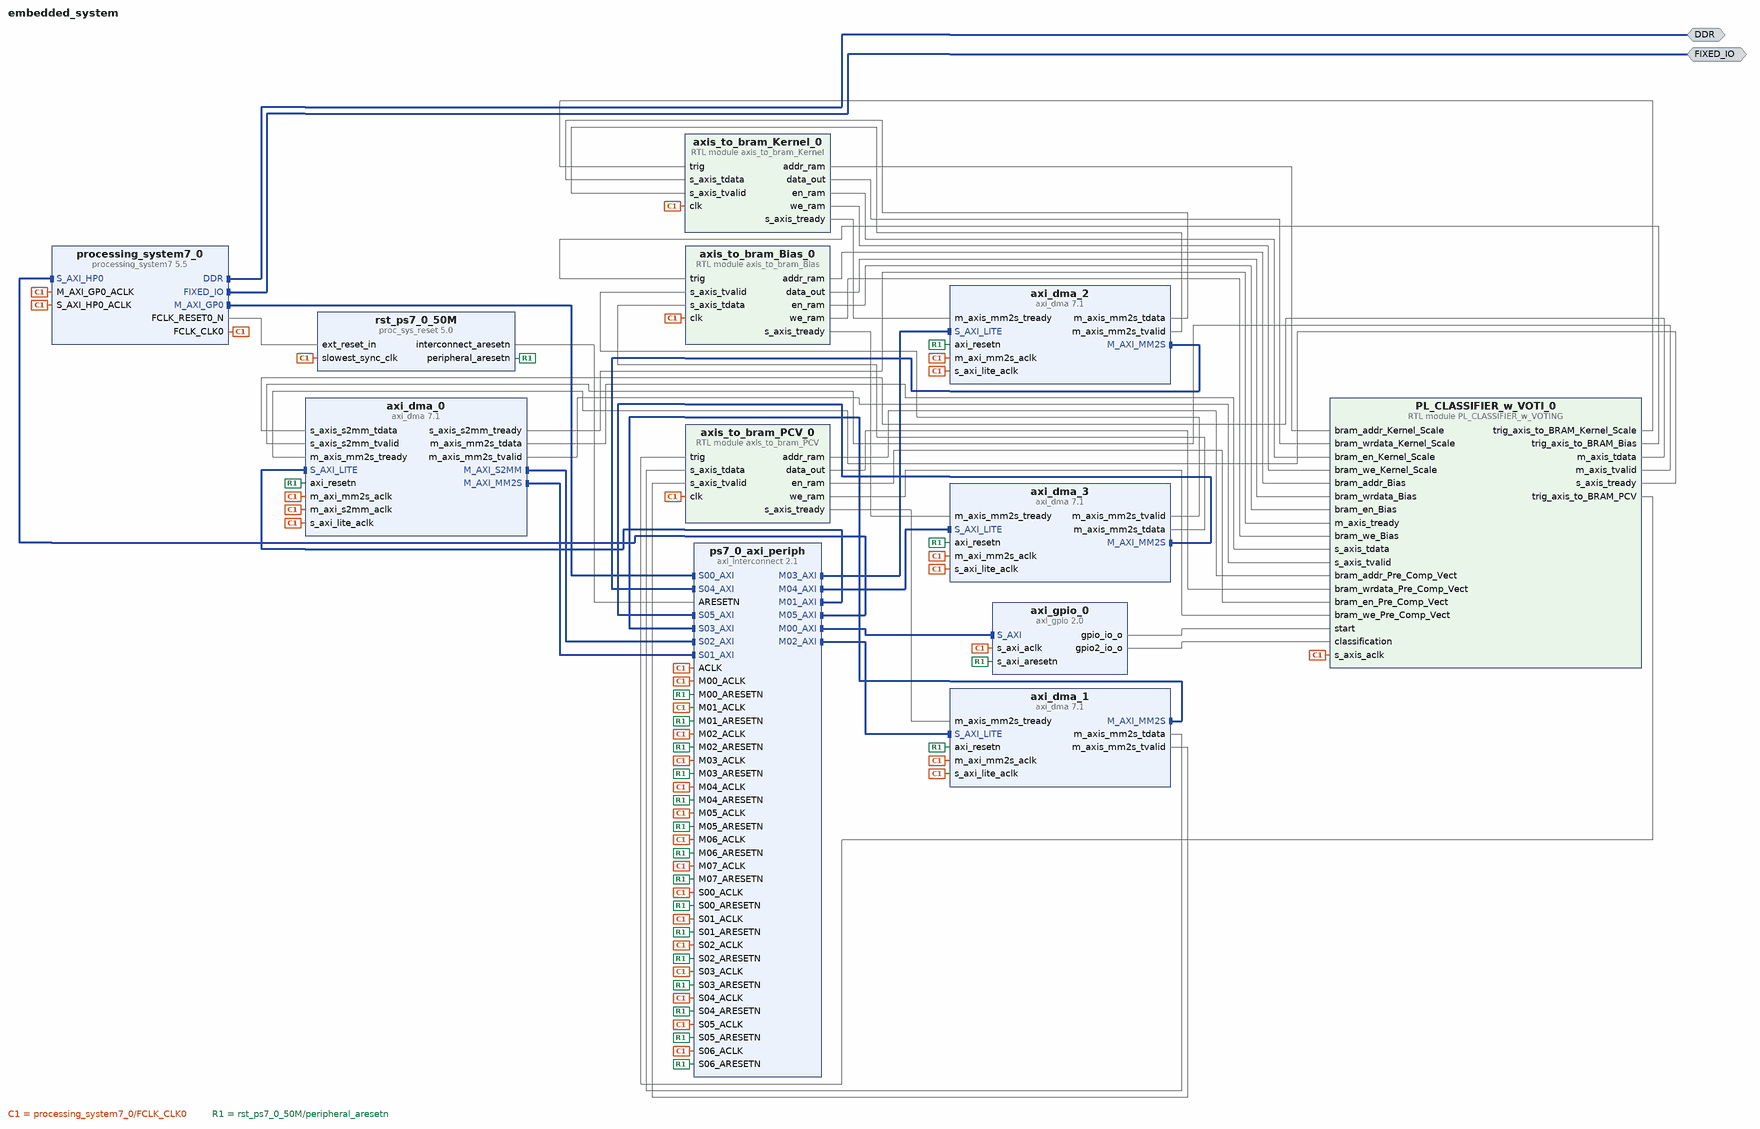
[diagram p0: block diagram of the top level]
# Vivado block design embedded_system, xc7z020clg400-1, Vivado 2018.3
create_bd_design embedded_system

create_bd_intf_port -mode Master -vlnv xilinx.com:interface:ddrx_rtl:1.0 DDR
create_bd_intf_port -mode Master -vlnv xilinx.com:display_processing_system7:fixedio_rtl:1.0 FIXED_IO

create_bd_cell -type ip -vlnv xilinx.com:ip:axi_gpio:2.0 axi_gpio_0
set_property -dict [list \
  CONFIG.C_ALL_INPUTS 0 \
  CONFIG.C_ALL_OUTPUTS 1 \
  CONFIG.C_ALL_OUTPUTS_2 1 \
  CONFIG.C_GPIO2_WIDTH 1 \
  CONFIG.C_GPIO_WIDTH 1 \
  CONFIG.C_IS_DUAL 1 \
  CONFIG.GPIO2_BOARD_INTERFACE Custom \
  CONFIG.GPIO_BOARD_INTERFACE Custom \
  CONFIG.USE_BOARD_FLOW true \
] [get_bd_cells axi_gpio_0]
create_bd_cell -type ip -vlnv xilinx.com:ip:axi_dma:7.1 axi_dma_0
set_property -dict [list \
  CONFIG.c_include_sg 0 \
  CONFIG.c_m_axi_mm2s_data_width 32 \
  CONFIG.c_micro_dma 0 \
  CONFIG.c_mm2s_burst_size 256 \
] [get_bd_cells axi_dma_0]
create_bd_cell -type ip -vlnv xilinx.com:ip:axi_interconnect:2.1 ps7_0_axi_periph
set_property -dict {CONFIG.NUM_MI 8 CONFIG.NUM_SI 7} [get_bd_cells ps7_0_axi_periph]
create_bd_cell -type ip -vlnv xilinx.com:ip:processing_system7:5.5 processing_system7_0
set_property -dict [list \
  CONFIG.PCW_APU_PERIPHERAL_FREQMHZ 650 \
  CONFIG.PCW_CRYSTAL_PERIPHERAL_FREQMHZ 50 \
  CONFIG.PCW_ENET0_ENET0_IO {MIO 16 .. 27} \
  CONFIG.PCW_ENET0_GRP_MDIO_ENABLE 1 \
  CONFIG.PCW_ENET0_GRP_MDIO_IO {MIO 52 .. 53} \
  CONFIG.PCW_ENET0_PERIPHERAL_ENABLE 1 \
  CONFIG.PCW_ENET0_RESET_ENABLE 1 \
  CONFIG.PCW_ENET0_RESET_IO {MIO 9} \
  CONFIG.PCW_ENET_RESET_ENABLE 1 \
  CONFIG.PCW_ENET_RESET_SELECT {Share reset pin} \
  CONFIG.PCW_FPGA0_PERIPHERAL_FREQMHZ 30 \
  CONFIG.PCW_FPGA1_PERIPHERAL_FREQMHZ 50 \
  CONFIG.PCW_GPIO_MIO_GPIO_ENABLE 1 \
  CONFIG.PCW_GPIO_MIO_GPIO_IO MIO \
  CONFIG.PCW_I2C_RESET_ENABLE 0 \
  CONFIG.PCW_M_AXI_GP0_FREQMHZ 10 \
  CONFIG.PCW_PERIPHERAL_BOARD_PRESET part0 \
  CONFIG.PCW_PRESET_BANK1_VOLTAGE {LVCMOS 1.8V} \
  CONFIG.PCW_QSPI_GRP_FBCLK_ENABLE 1 \
  CONFIG.PCW_QSPI_GRP_FBCLK_IO {MIO 8} \
  CONFIG.PCW_QSPI_GRP_SINGLE_SS_ENABLE 1 \
  CONFIG.PCW_QSPI_GRP_SINGLE_SS_IO {MIO 1 .. 6} \
  CONFIG.PCW_QSPI_PERIPHERAL_ENABLE 1 \
  CONFIG.PCW_QSPI_QSPI_IO {MIO 1 .. 6} \
  CONFIG.PCW_SD0_GRP_CD_ENABLE 1 \
  CONFIG.PCW_SD0_GRP_CD_IO {MIO 47} \
  CONFIG.PCW_SD0_GRP_WP_ENABLE 0 \
  CONFIG.PCW_SD0_PERIPHERAL_ENABLE 1 \
  CONFIG.PCW_SD0_SD0_IO {MIO 40 .. 45} \
  CONFIG.PCW_SDIO_PERIPHERAL_FREQMHZ 50 \
  CONFIG.PCW_SINGLE_QSPI_DATA_MODE x4 \
  CONFIG.PCW_S_AXI_HP0_DATA_WIDTH 32 \
  CONFIG.PCW_S_AXI_HP0_FREQMHZ 10 \
  CONFIG.PCW_UART0_PERIPHERAL_ENABLE 1 \
  CONFIG.PCW_UART0_UART0_IO {MIO 14 .. 15} \
  CONFIG.PCW_UART1_PERIPHERAL_ENABLE 0 \
  CONFIG.PCW_UART_PERIPHERAL_FREQMHZ 100 \
  CONFIG.PCW_UIPARAM_DDR_BUS_WIDTH {16 Bit} \
  CONFIG.PCW_UIPARAM_DDR_FREQ_MHZ 525 \
  CONFIG.PCW_UIPARAM_DDR_PARTNO {MT41J256M16 RE-125} \
  CONFIG.PCW_USB0_PERIPHERAL_ENABLE 1 \
  CONFIG.PCW_USB0_RESET_ENABLE 1 \
  CONFIG.PCW_USB0_RESET_IO {MIO 46} \
  CONFIG.PCW_USB0_USB0_IO {MIO 28 .. 39} \
  CONFIG.PCW_USB_RESET_ENABLE 1 \
  CONFIG.PCW_USB_RESET_SELECT {Share reset pin} \
  CONFIG.PCW_USE_S_AXI_HP0 1 \
] [get_bd_cells processing_system7_0]
# 485 more settings of processing_system7_0 are not shown: defaults, MIO pin electricals, DDR timing, and values the tool derives
create_bd_cell -type ip -vlnv xilinx.com:ip:proc_sys_reset:5.0 rst_ps7_0_50M
set_property -dict {CONFIG.C_EXT_RST_WIDTH 4} [get_bd_cells rst_ps7_0_50M]
create_bd_cell -type ip -vlnv xilinx.com:ip:axi_dma:7.1 axi_dma_1
set_property -dict [list \
  CONFIG.c_include_mm2s 1 \
  CONFIG.c_include_s2mm 0 \
  CONFIG.c_include_sg 0 \
  CONFIG.c_m_axi_mm2s_data_width 32 \
  CONFIG.c_micro_dma 0 \
  CONFIG.c_mm2s_burst_size 256 \
  CONFIG.c_sg_length_width 10 \
] [get_bd_cells axi_dma_1]
create_bd_cell -type ip -vlnv xilinx.com:ip:axi_dma:7.1 axi_dma_2
set_property -dict [list \
  CONFIG.c_include_mm2s 1 \
  CONFIG.c_include_s2mm 0 \
  CONFIG.c_include_sg 0 \
  CONFIG.c_m_axi_mm2s_data_width 32 \
  CONFIG.c_micro_dma 0 \
  CONFIG.c_mm2s_burst_size 256 \
  CONFIG.c_sg_length_width 10 \
] [get_bd_cells axi_dma_2]
create_bd_cell -type ip -vlnv xilinx.com:ip:axi_dma:7.1 axi_dma_3
set_property -dict [list \
  CONFIG.c_include_mm2s 1 \
  CONFIG.c_include_s2mm 0 \
  CONFIG.c_include_sg 0 \
  CONFIG.c_m_axi_mm2s_data_width 32 \
  CONFIG.c_micro_dma 0 \
  CONFIG.c_mm2s_burst_size 256 \
  CONFIG.c_sg_length_width 10 \
] [get_bd_cells axi_dma_3]
create_bd_cell -type module -reference axis_to_bram_PCV axis_to_bram_PCV_0
create_bd_cell -type module -reference axis_to_bram_Bias axis_to_bram_Bias_0
create_bd_cell -type module -reference axis_to_bram_Kernel axis_to_bram_Kernel_0
create_bd_cell -type module -reference PL_CLASSIFIER_w_VOTING PL_CLASSIFIER_w_VOTI_0

# ---- connections ----

connect_bd_intf_net [get_bd_intf_ports DDR] [get_bd_intf_pins processing_system7_0/DDR]
connect_bd_intf_net [get_bd_intf_pins ps7_0_axi_periph/M03_AXI] [get_bd_intf_pins axi_dma_2/S_AXI_LITE]
connect_bd_intf_net [get_bd_intf_pins processing_system7_0/M_AXI_GP0] [get_bd_intf_pins ps7_0_axi_periph/S00_AXI]
connect_bd_intf_net [get_bd_intf_pins ps7_0_axi_periph/M00_AXI] [get_bd_intf_pins axi_gpio_0/S_AXI]
connect_bd_intf_net [get_bd_intf_pins axi_dma_0/M_AXI_S2MM] [get_bd_intf_pins ps7_0_axi_periph/S02_AXI]
connect_bd_intf_net [get_bd_intf_pins axi_dma_2/M_AXI_MM2S] [get_bd_intf_pins ps7_0_axi_periph/S04_AXI]
connect_bd_intf_net [get_bd_intf_pins axi_dma_3/M_AXI_MM2S] [get_bd_intf_pins ps7_0_axi_periph/S05_AXI]
connect_bd_intf_net [get_bd_intf_pins ps7_0_axi_periph/M04_AXI] [get_bd_intf_pins axi_dma_3/S_AXI_LITE]
connect_bd_intf_net [get_bd_intf_pins ps7_0_axi_periph/M01_AXI] [get_bd_intf_pins axi_dma_0/S_AXI_LITE]
connect_bd_intf_net [get_bd_intf_pins axi_dma_1/M_AXI_MM2S] [get_bd_intf_pins ps7_0_axi_periph/S03_AXI]
connect_bd_intf_net [get_bd_intf_pins ps7_0_axi_periph/M05_AXI] [get_bd_intf_pins processing_system7_0/S_AXI_HP0]
connect_bd_intf_net [get_bd_intf_pins ps7_0_axi_periph/M02_AXI] [get_bd_intf_pins axi_dma_1/S_AXI_LITE]
connect_bd_intf_net [get_bd_intf_ports FIXED_IO] [get_bd_intf_pins processing_system7_0/FIXED_IO]
connect_bd_intf_net [get_bd_intf_pins axi_dma_0/M_AXI_MM2S] [get_bd_intf_pins ps7_0_axi_periph/S01_AXI]
connect_bd_net [get_bd_pins processing_system7_0/FCLK_CLK0] \
  [get_bd_pins processing_system7_0/M_AXI_GP0_ACLK] [get_bd_pins ps7_0_axi_periph/S00_ACLK] \
  [get_bd_pins axi_gpio_0/s_axi_aclk] [get_bd_pins ps7_0_axi_periph/M00_ACLK] [get_bd_pins axi_dma_0/s_axi_lite_aclk] \
  [get_bd_pins ps7_0_axi_periph/M01_ACLK] [get_bd_pins axi_dma_0/m_axi_mm2s_aclk] [get_bd_pins axi_dma_0/m_axi_s2mm_aclk] \
  [get_bd_pins ps7_0_axi_periph/M02_ACLK] [get_bd_pins ps7_0_axi_periph/M03_ACLK] [get_bd_pins ps7_0_axi_periph/M04_ACLK] \
  [get_bd_pins ps7_0_axi_periph/ACLK] [get_bd_pins ps7_0_axi_periph/S01_ACLK] [get_bd_pins ps7_0_axi_periph/S02_ACLK] \
  [get_bd_pins processing_system7_0/S_AXI_HP0_ACLK] [get_bd_pins ps7_0_axi_periph/M05_ACLK] \
  [get_bd_pins rst_ps7_0_50M/slowest_sync_clk] [get_bd_pins ps7_0_axi_periph/M06_ACLK] \
  [get_bd_pins axi_dma_1/s_axi_lite_aclk] [get_bd_pins ps7_0_axi_periph/S03_ACLK] [get_bd_pins axi_dma_2/s_axi_lite_aclk] \
  [get_bd_pins ps7_0_axi_periph/S04_ACLK] [get_bd_pins axi_dma_3/s_axi_lite_aclk] [get_bd_pins ps7_0_axi_periph/S05_ACLK] \
  [get_bd_pins axi_dma_1/m_axi_mm2s_aclk] [get_bd_pins axi_dma_2/m_axi_mm2s_aclk] [get_bd_pins axi_dma_3/m_axi_mm2s_aclk] \
  [get_bd_pins ps7_0_axi_periph/S06_ACLK] [get_bd_pins ps7_0_axi_periph/M07_ACLK] [get_bd_pins axis_to_bram_PCV_0/clk] \
  [get_bd_pins axis_to_bram_Bias_0/clk] [get_bd_pins axis_to_bram_Kernel_0/clk] \
  [get_bd_pins PL_CLASSIFIER_w_VOTI_0/s_axis_aclk]
connect_bd_net [get_bd_pins processing_system7_0/FCLK_RESET0_N] [get_bd_pins rst_ps7_0_50M/ext_reset_in]
connect_bd_net [get_bd_pins rst_ps7_0_50M/interconnect_aresetn] [get_bd_pins ps7_0_axi_periph/ARESETN]
connect_bd_net [get_bd_pins rst_ps7_0_50M/peripheral_aresetn] \
  [get_bd_pins ps7_0_axi_periph/S00_ARESETN] [get_bd_pins ps7_0_axi_periph/M00_ARESETN] \
  [get_bd_pins ps7_0_axi_periph/M01_ARESETN] [get_bd_pins ps7_0_axi_periph/M02_ARESETN] \
  [get_bd_pins ps7_0_axi_periph/M03_ARESETN] [get_bd_pins ps7_0_axi_periph/M04_ARESETN] \
  [get_bd_pins ps7_0_axi_periph/S01_ARESETN] [get_bd_pins ps7_0_axi_periph/S02_ARESETN] \
  [get_bd_pins ps7_0_axi_periph/M05_ARESETN] [get_bd_pins ps7_0_axi_periph/M06_ARESETN] [get_bd_pins axi_dma_0/axi_resetn] \
  [get_bd_pins axi_dma_1/axi_resetn] [get_bd_pins ps7_0_axi_periph/S03_ARESETN] [get_bd_pins axi_dma_2/axi_resetn] \
  [get_bd_pins ps7_0_axi_periph/S04_ARESETN] [get_bd_pins axi_dma_3/axi_resetn] [get_bd_pins ps7_0_axi_periph/S05_ARESETN] \
  [get_bd_pins axi_gpio_0/s_axi_aresetn] [get_bd_pins ps7_0_axi_periph/S06_ARESETN] \
  [get_bd_pins ps7_0_axi_periph/M07_ARESETN]
connect_bd_net [get_bd_pins axi_gpio_0/gpio_io_o] [get_bd_pins PL_CLASSIFIER_w_VOTI_0/start]
connect_bd_net [get_bd_pins axi_gpio_0/gpio2_io_o] [get_bd_pins PL_CLASSIFIER_w_VOTI_0/classification]
connect_bd_net [get_bd_pins axis_to_bram_PCV_0/addr_ram] [get_bd_pins PL_CLASSIFIER_w_VOTI_0/bram_addr_Pre_Comp_Vect]
connect_bd_net [get_bd_pins axis_to_bram_PCV_0/data_out] [get_bd_pins PL_CLASSIFIER_w_VOTI_0/bram_wrdata_Pre_Comp_Vect]
connect_bd_net [get_bd_pins axis_to_bram_PCV_0/en_ram] [get_bd_pins PL_CLASSIFIER_w_VOTI_0/bram_en_Pre_Comp_Vect]
connect_bd_net [get_bd_pins axis_to_bram_PCV_0/we_ram] [get_bd_pins PL_CLASSIFIER_w_VOTI_0/bram_we_Pre_Comp_Vect]
connect_bd_net [get_bd_pins axis_to_bram_Kernel_0/addr_ram] [get_bd_pins PL_CLASSIFIER_w_VOTI_0/bram_addr_Kernel_Scale]
connect_bd_net [get_bd_pins axis_to_bram_Kernel_0/data_out] [get_bd_pins PL_CLASSIFIER_w_VOTI_0/bram_wrdata_Kernel_Scale]
connect_bd_net [get_bd_pins axis_to_bram_Kernel_0/en_ram] [get_bd_pins PL_CLASSIFIER_w_VOTI_0/bram_en_Kernel_Scale]
connect_bd_net [get_bd_pins axis_to_bram_Kernel_0/we_ram] [get_bd_pins PL_CLASSIFIER_w_VOTI_0/bram_we_Kernel_Scale]
connect_bd_net [get_bd_pins axis_to_bram_Bias_0/addr_ram] [get_bd_pins PL_CLASSIFIER_w_VOTI_0/bram_addr_Bias]
connect_bd_net [get_bd_pins axis_to_bram_Bias_0/data_out] [get_bd_pins PL_CLASSIFIER_w_VOTI_0/bram_wrdata_Bias]
connect_bd_net [get_bd_pins axis_to_bram_Bias_0/en_ram] [get_bd_pins PL_CLASSIFIER_w_VOTI_0/bram_en_Bias]
connect_bd_net [get_bd_pins axis_to_bram_Bias_0/we_ram] [get_bd_pins PL_CLASSIFIER_w_VOTI_0/bram_we_Bias]
connect_bd_net [get_bd_pins PL_CLASSIFIER_w_VOTI_0/trig_axis_to_BRAM_PCV] [get_bd_pins axis_to_bram_PCV_0/trig]
connect_bd_net [get_bd_pins PL_CLASSIFIER_w_VOTI_0/trig_axis_to_BRAM_Kernel_Scale] [get_bd_pins axis_to_bram_Kernel_0/trig]
connect_bd_net [get_bd_pins PL_CLASSIFIER_w_VOTI_0/trig_axis_to_BRAM_Bias] [get_bd_pins axis_to_bram_Bias_0/trig]
connect_bd_net [get_bd_pins axi_dma_1/m_axis_mm2s_tdata] [get_bd_pins axis_to_bram_PCV_0/s_axis_tdata]
connect_bd_net [get_bd_pins axi_dma_1/m_axis_mm2s_tvalid] [get_bd_pins axis_to_bram_PCV_0/s_axis_tvalid]
connect_bd_net [get_bd_pins axis_to_bram_PCV_0/s_axis_tready] [get_bd_pins axi_dma_1/m_axis_mm2s_tready]
connect_bd_net [get_bd_pins axi_dma_2/m_axis_mm2s_tdata] [get_bd_pins axis_to_bram_Kernel_0/s_axis_tdata]
connect_bd_net [get_bd_pins axis_to_bram_Kernel_0/s_axis_tready] [get_bd_pins axi_dma_2/m_axis_mm2s_tready]
connect_bd_net [get_bd_pins axi_dma_2/m_axis_mm2s_tvalid] [get_bd_pins axis_to_bram_Kernel_0/s_axis_tvalid]
connect_bd_net [get_bd_pins axis_to_bram_Bias_0/s_axis_tready] [get_bd_pins axi_dma_3/m_axis_mm2s_tready]
connect_bd_net [get_bd_pins axi_dma_3/m_axis_mm2s_tvalid] [get_bd_pins axis_to_bram_Bias_0/s_axis_tvalid]
connect_bd_net [get_bd_pins axi_dma_3/m_axis_mm2s_tdata] [get_bd_pins axis_to_bram_Bias_0/s_axis_tdata]
connect_bd_net [get_bd_pins PL_CLASSIFIER_w_VOTI_0/m_axis_tdata] [get_bd_pins axi_dma_0/s_axis_s2mm_tdata]
connect_bd_net [get_bd_pins PL_CLASSIFIER_w_VOTI_0/m_axis_tvalid] [get_bd_pins axi_dma_0/s_axis_s2mm_tvalid]
connect_bd_net [get_bd_pins axi_dma_0/s_axis_s2mm_tready] [get_bd_pins PL_CLASSIFIER_w_VOTI_0/m_axis_tready]
connect_bd_net [get_bd_pins axi_dma_0/m_axis_mm2s_tdata] [get_bd_pins PL_CLASSIFIER_w_VOTI_0/s_axis_tdata]
connect_bd_net [get_bd_pins axi_dma_0/m_axis_mm2s_tvalid] [get_bd_pins PL_CLASSIFIER_w_VOTI_0/s_axis_tvalid]
connect_bd_net [get_bd_pins PL_CLASSIFIER_w_VOTI_0/s_axis_tready] [get_bd_pins axi_dma_0/m_axis_mm2s_tready]
set_property HDL_ATTRIBUTE.BMM_INFO_PROCESSOR {arm > embedded_system axi_bram_ctrl_0} [get_bd_cells processing_system7_0]
set_property HDL_ATTRIBUTE.KEEP_HIERARCHY yes [get_bd_cells processing_system7_0]

# ---- address map ----
assign_bd_address -offset 0x40000000 -range 512M -target_address_space [get_bd_addr_spaces axi_dma_0/Data_MM2S] [get_bd_addr_segs processing_system7_0/S_AXI_HP0/HP0_DDR_LOWOCM]
exclude_bd_addr_seg -offset 0x60000000 -range 64K -target_address_space [get_bd_addr_spaces axi_dma_0/Data_MM2S] [get_bd_addr_segs axi_dma_1/S_AXI_LITE/Reg]
exclude_bd_addr_seg -offset 0x60010000 -range 64K -target_address_space [get_bd_addr_spaces axi_dma_0/Data_MM2S] [get_bd_addr_segs axi_dma_0/S_AXI_LITE/Reg]
exclude_bd_addr_seg -offset 0x60020000 -range 64K -target_address_space [get_bd_addr_spaces axi_dma_0/Data_MM2S] [get_bd_addr_segs axi_gpio_0/S_AXI/Reg]
exclude_bd_addr_seg -offset 0x60030000 -range 64K -target_address_space [get_bd_addr_spaces axi_dma_0/Data_MM2S] [get_bd_addr_segs axi_dma_2/S_AXI_LITE/Reg]
exclude_bd_addr_seg -offset 0x60040000 -range 64K -target_address_space [get_bd_addr_spaces axi_dma_0/Data_MM2S] [get_bd_addr_segs axi_dma_3/S_AXI_LITE/Reg]
assign_bd_address -offset 0x40000000 -range 512M -target_address_space [get_bd_addr_spaces axi_dma_0/Data_S2MM] [get_bd_addr_segs processing_system7_0/S_AXI_HP0/HP0_DDR_LOWOCM]
exclude_bd_addr_seg -offset 0x60000000 -range 64K -target_address_space [get_bd_addr_spaces axi_dma_0/Data_S2MM] [get_bd_addr_segs axi_dma_1/S_AXI_LITE/Reg]
exclude_bd_addr_seg -offset 0x60010000 -range 64K -target_address_space [get_bd_addr_spaces axi_dma_0/Data_S2MM] [get_bd_addr_segs axi_dma_0/S_AXI_LITE/Reg]
exclude_bd_addr_seg -offset 0x60020000 -range 64K -target_address_space [get_bd_addr_spaces axi_dma_0/Data_S2MM] [get_bd_addr_segs axi_gpio_0/S_AXI/Reg]
exclude_bd_addr_seg -offset 0x60030000 -range 64K -target_address_space [get_bd_addr_spaces axi_dma_0/Data_S2MM] [get_bd_addr_segs axi_dma_2/S_AXI_LITE/Reg]
exclude_bd_addr_seg -offset 0x60040000 -range 64K -target_address_space [get_bd_addr_spaces axi_dma_0/Data_S2MM] [get_bd_addr_segs axi_dma_3/S_AXI_LITE/Reg]
assign_bd_address -offset 0x40000000 -range 512M -target_address_space [get_bd_addr_spaces axi_dma_1/Data_MM2S] [get_bd_addr_segs processing_system7_0/S_AXI_HP0/HP0_DDR_LOWOCM]
exclude_bd_addr_seg -offset 0x60000000 -range 64K -target_address_space [get_bd_addr_spaces axi_dma_1/Data_MM2S] [get_bd_addr_segs axi_dma_1/S_AXI_LITE/Reg]
exclude_bd_addr_seg -offset 0x60010000 -range 64K -target_address_space [get_bd_addr_spaces axi_dma_1/Data_MM2S] [get_bd_addr_segs axi_dma_0/S_AXI_LITE/Reg]
exclude_bd_addr_seg -offset 0x60020000 -range 64K -target_address_space [get_bd_addr_spaces axi_dma_1/Data_MM2S] [get_bd_addr_segs axi_gpio_0/S_AXI/Reg]
exclude_bd_addr_seg -offset 0x60030000 -range 64K -target_address_space [get_bd_addr_spaces axi_dma_1/Data_MM2S] [get_bd_addr_segs axi_dma_2/S_AXI_LITE/Reg]
exclude_bd_addr_seg -offset 0x60040000 -range 64K -target_address_space [get_bd_addr_spaces axi_dma_1/Data_MM2S] [get_bd_addr_segs axi_dma_3/S_AXI_LITE/Reg]
assign_bd_address -offset 0x40000000 -range 512M -target_address_space [get_bd_addr_spaces axi_dma_2/Data_MM2S] [get_bd_addr_segs processing_system7_0/S_AXI_HP0/HP0_DDR_LOWOCM]
exclude_bd_addr_seg -offset 0x60000000 -range 64K -target_address_space [get_bd_addr_spaces axi_dma_2/Data_MM2S] [get_bd_addr_segs axi_dma_1/S_AXI_LITE/Reg]
exclude_bd_addr_seg -offset 0x60010000 -range 64K -target_address_space [get_bd_addr_spaces axi_dma_2/Data_MM2S] [get_bd_addr_segs axi_dma_0/S_AXI_LITE/Reg]
exclude_bd_addr_seg -offset 0x60020000 -range 64K -target_address_space [get_bd_addr_spaces axi_dma_2/Data_MM2S] [get_bd_addr_segs axi_gpio_0/S_AXI/Reg]
exclude_bd_addr_seg -offset 0x60030000 -range 64K -target_address_space [get_bd_addr_spaces axi_dma_2/Data_MM2S] [get_bd_addr_segs axi_dma_2/S_AXI_LITE/Reg]
exclude_bd_addr_seg -offset 0x60040000 -range 64K -target_address_space [get_bd_addr_spaces axi_dma_2/Data_MM2S] [get_bd_addr_segs axi_dma_3/S_AXI_LITE/Reg]
assign_bd_address -offset 0x40000000 -range 512M -target_address_space [get_bd_addr_spaces axi_dma_3/Data_MM2S] [get_bd_addr_segs processing_system7_0/S_AXI_HP0/HP0_DDR_LOWOCM]
exclude_bd_addr_seg -offset 0x60000000 -range 64K -target_address_space [get_bd_addr_spaces axi_dma_3/Data_MM2S] [get_bd_addr_segs axi_dma_1/S_AXI_LITE/Reg]
exclude_bd_addr_seg -offset 0x60010000 -range 64K -target_address_space [get_bd_addr_spaces axi_dma_3/Data_MM2S] [get_bd_addr_segs axi_dma_0/S_AXI_LITE/Reg]
exclude_bd_addr_seg -offset 0x60020000 -range 64K -target_address_space [get_bd_addr_spaces axi_dma_3/Data_MM2S] [get_bd_addr_segs axi_gpio_0/S_AXI/Reg]
exclude_bd_addr_seg -offset 0x60030000 -range 64K -target_address_space [get_bd_addr_spaces axi_dma_3/Data_MM2S] [get_bd_addr_segs axi_dma_2/S_AXI_LITE/Reg]
exclude_bd_addr_seg -offset 0x60040000 -range 64K -target_address_space [get_bd_addr_spaces axi_dma_3/Data_MM2S] [get_bd_addr_segs axi_dma_3/S_AXI_LITE/Reg]
assign_bd_address -offset 0x40000000 -range 512M -target_address_space [get_bd_addr_spaces processing_system7_0/Data] [get_bd_addr_segs processing_system7_0/S_AXI_HP0/HP0_DDR_LOWOCM]
assign_bd_address -offset 0x60000000 -range 64K -target_address_space [get_bd_addr_spaces processing_system7_0/Data] [get_bd_addr_segs axi_dma_1/S_AXI_LITE/Reg]
assign_bd_address -offset 0x60010000 -range 64K -target_address_space [get_bd_addr_spaces processing_system7_0/Data] [get_bd_addr_segs axi_dma_0/S_AXI_LITE/Reg]
assign_bd_address -offset 0x60020000 -range 64K -target_address_space [get_bd_addr_spaces processing_system7_0/Data] [get_bd_addr_segs axi_gpio_0/S_AXI/Reg]
assign_bd_address -offset 0x60030000 -range 64K -target_address_space [get_bd_addr_spaces processing_system7_0/Data] [get_bd_addr_segs axi_dma_2/S_AXI_LITE/Reg]
assign_bd_address -offset 0x60040000 -range 64K -target_address_space [get_bd_addr_spaces processing_system7_0/Data] [get_bd_addr_segs axi_dma_3/S_AXI_LITE/Reg]

validate_bd_design
save_bd_design
